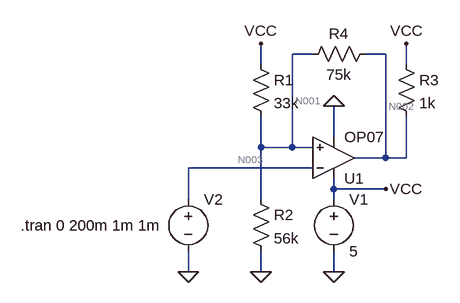
[diagram p0: schematic Comparer.asc]
Comparer.asc, the LTspice schematic file:
Version 4
SHEET 1 2800 680
WIRE 176 0 144 0
WIRE 288 0 256 0
WIRE 96 16 96 -16
WIRE 320 16 320 -16
WIRE 208 128 208 80
WIRE 96 144 96 96
WIRE 144 144 144 0
WIRE 144 144 96 144
WIRE 176 144 144 144
WIRE 288 160 288 0
WIRE 288 160 240 160
WIRE 320 160 320 96
WIRE 320 160 288 160
WIRE 176 176 -16 176
WIRE 208 208 208 192
WIRE 288 208 208 208
WIRE -16 224 -16 176
WIRE 96 224 96 144
WIRE 208 224 208 208
WIRE -16 336 -16 304
WIRE 96 336 96 304
WIRE 208 336 208 304
FLAG 208 80 0
FLAG 208 336 0
FLAG 96 336 0
FLAG 288 208 VCC
FLAG 96 -16 VCC
FLAG 320 -16 VCC
FLAG -16 336 0
SYMBOL Opamps\\OP07 208 224 M180
SYMATTR InstName U1
SYMBOL res 80 0 R0
SYMATTR InstName R1
SYMATTR Value 33k
SYMBOL res 80 208 R0
SYMATTR InstName R2
SYMATTR Value 56k
SYMBOL voltage 208 208 R0
WINDOW 123 0 0 Left 2
WINDOW 39 0 0 Left 2
SYMATTR InstName V1
SYMATTR Value 5
SYMBOL res 304 0 R0
SYMATTR InstName R3
SYMATTR Value 1k
SYMBOL voltage -16 208 R0
WINDOW 3 24 96 Invisible 2
WINDOW 123 0 0 Left 2
WINDOW 39 0 0 Left 2
SYMATTR InstName V2
SYMATTR Value PWL(10ms 2.5 20ms 3.1 30ms 3.2 40ms 3.3 50ms 3.4 60ms 3.5 70ms 3.6 80ms 3.6 90ms 3.6 100ms 3.6 110ms 3.5 120ms 3.4 130ms 3.3 140ms 3.2 150ms 3.1 160ms 3.0 170ms 2.9 180ms 2.8 190ms 2.7 200ms 2.6 210ms 2.5)
SYMBOL res 272 -16 R90
WINDOW 0 0 56 VBottom 2
WINDOW 3 32 56 VTop 2
SYMATTR InstName R4
SYMATTR Value 75k
TEXT -274 264 Left 2 !.tran 0 200m 1m 1m

The netlist it stands for:
* Comparer.asc
XU1 N001 N003 VCC 0 N002 LT1001  ; OP07, pins In+ In- V+ V- OUT
R1 VCC N001 33k
R2 N001 0 56k
V1 VCC 0 5
R3 VCC N002 1k
V2 N003 0 PWL(10ms 2.5 20ms 3.1 30ms 3.2 40ms 3.3 50ms 3.4 60ms 3.5 70ms 3.6 80ms 3.6 90ms 3.6 100ms 3.6 110ms 3.5 120ms 3.4 130ms 3.3 140ms 3.2 150ms 3.1 160ms 3.0 170ms 2.9 180ms 2.8 190ms 2.7 200ms 2.6 210ms 2.5)
R4 N002 N001 75k
.tran 0 200m 1m 1m
.lib LTC.lib
.backanno
.end

* Results of the author's LTspice run, read from the files saved beside the schematic
* Operating Point, zero values left out:
*   V(n003) = 2.5 V
*   V(n001) = 3.353 V
*   V(vcc) = 5 V
*   V(n002) = 4.102 V
*   I(R4) = 9.983 µA
*   I(R3) = 898.1 µA
*   I(R2) = 59.88 µA
*   I(R1) = 49.91 µA
*   I(V2) = 11.52 nA
*   I(V1) = -2.773 mA
*   Ix(u1:1) = 11.52 nA
*   Ix(u1:2) = -11.52 nA
*   Ix(u1:3) = 1.825 mA
*   Ix(u1:4) = -2.72 mA
*   Ix(u1:5) = 888.1 µA
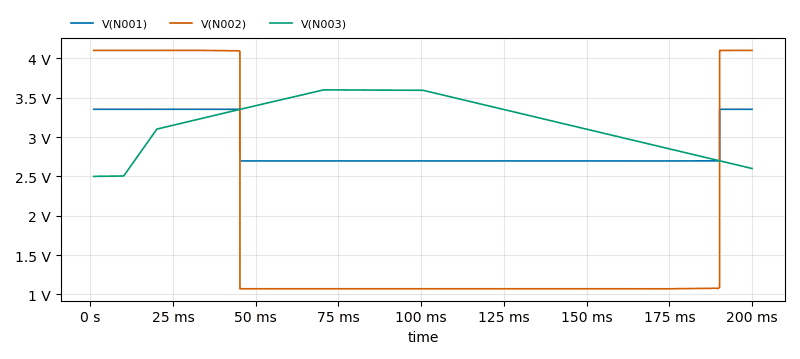
[diagram p1: Transient Analysis of Comparer.asc, plotted from the saved traces]
* Transient Analysis, 1 run:
*   V(N001): min 2.696 V, max 3.353 V, average 2.875 V, rms 2.889 V, last 3.353 V
*   V(N002): min 1.07 V, max 4.102 V, average 1.894 V, rms 2.324 V, last 4.102 V
*   V(N003): min 2.5 V, max 3.6 V, average 3.195 V, rms 3.216 V, last 2.6 V